# EAGLE schematic WM1302_915_SPI_without SX1262_SKY66420_v1.3 (EAGLE 6.4)
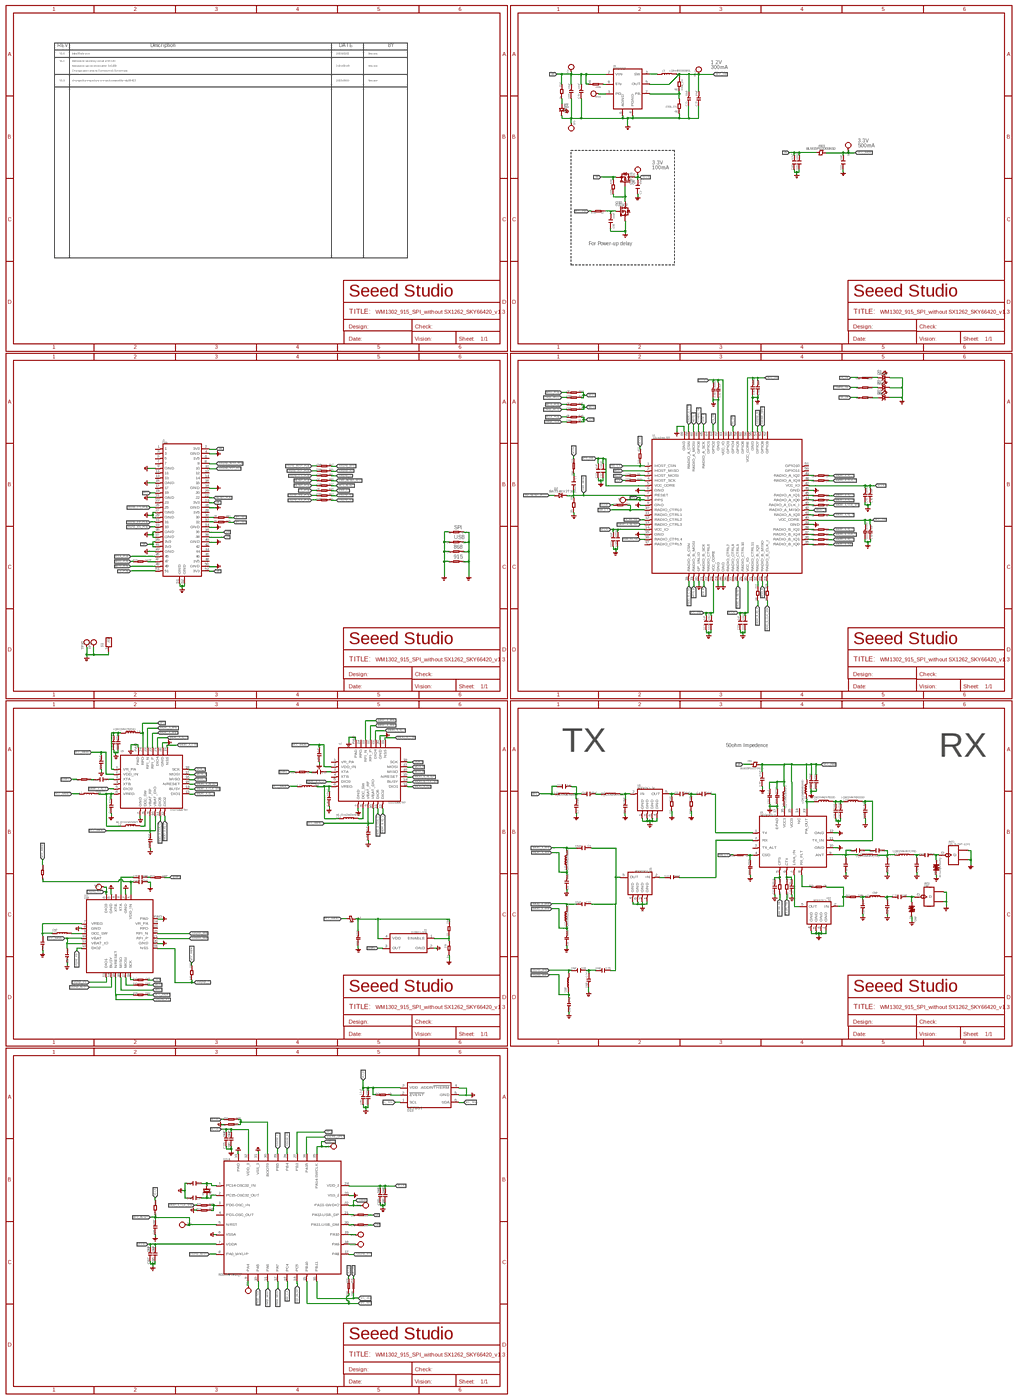
[diagram p0: schematic, sheet 1, overview]
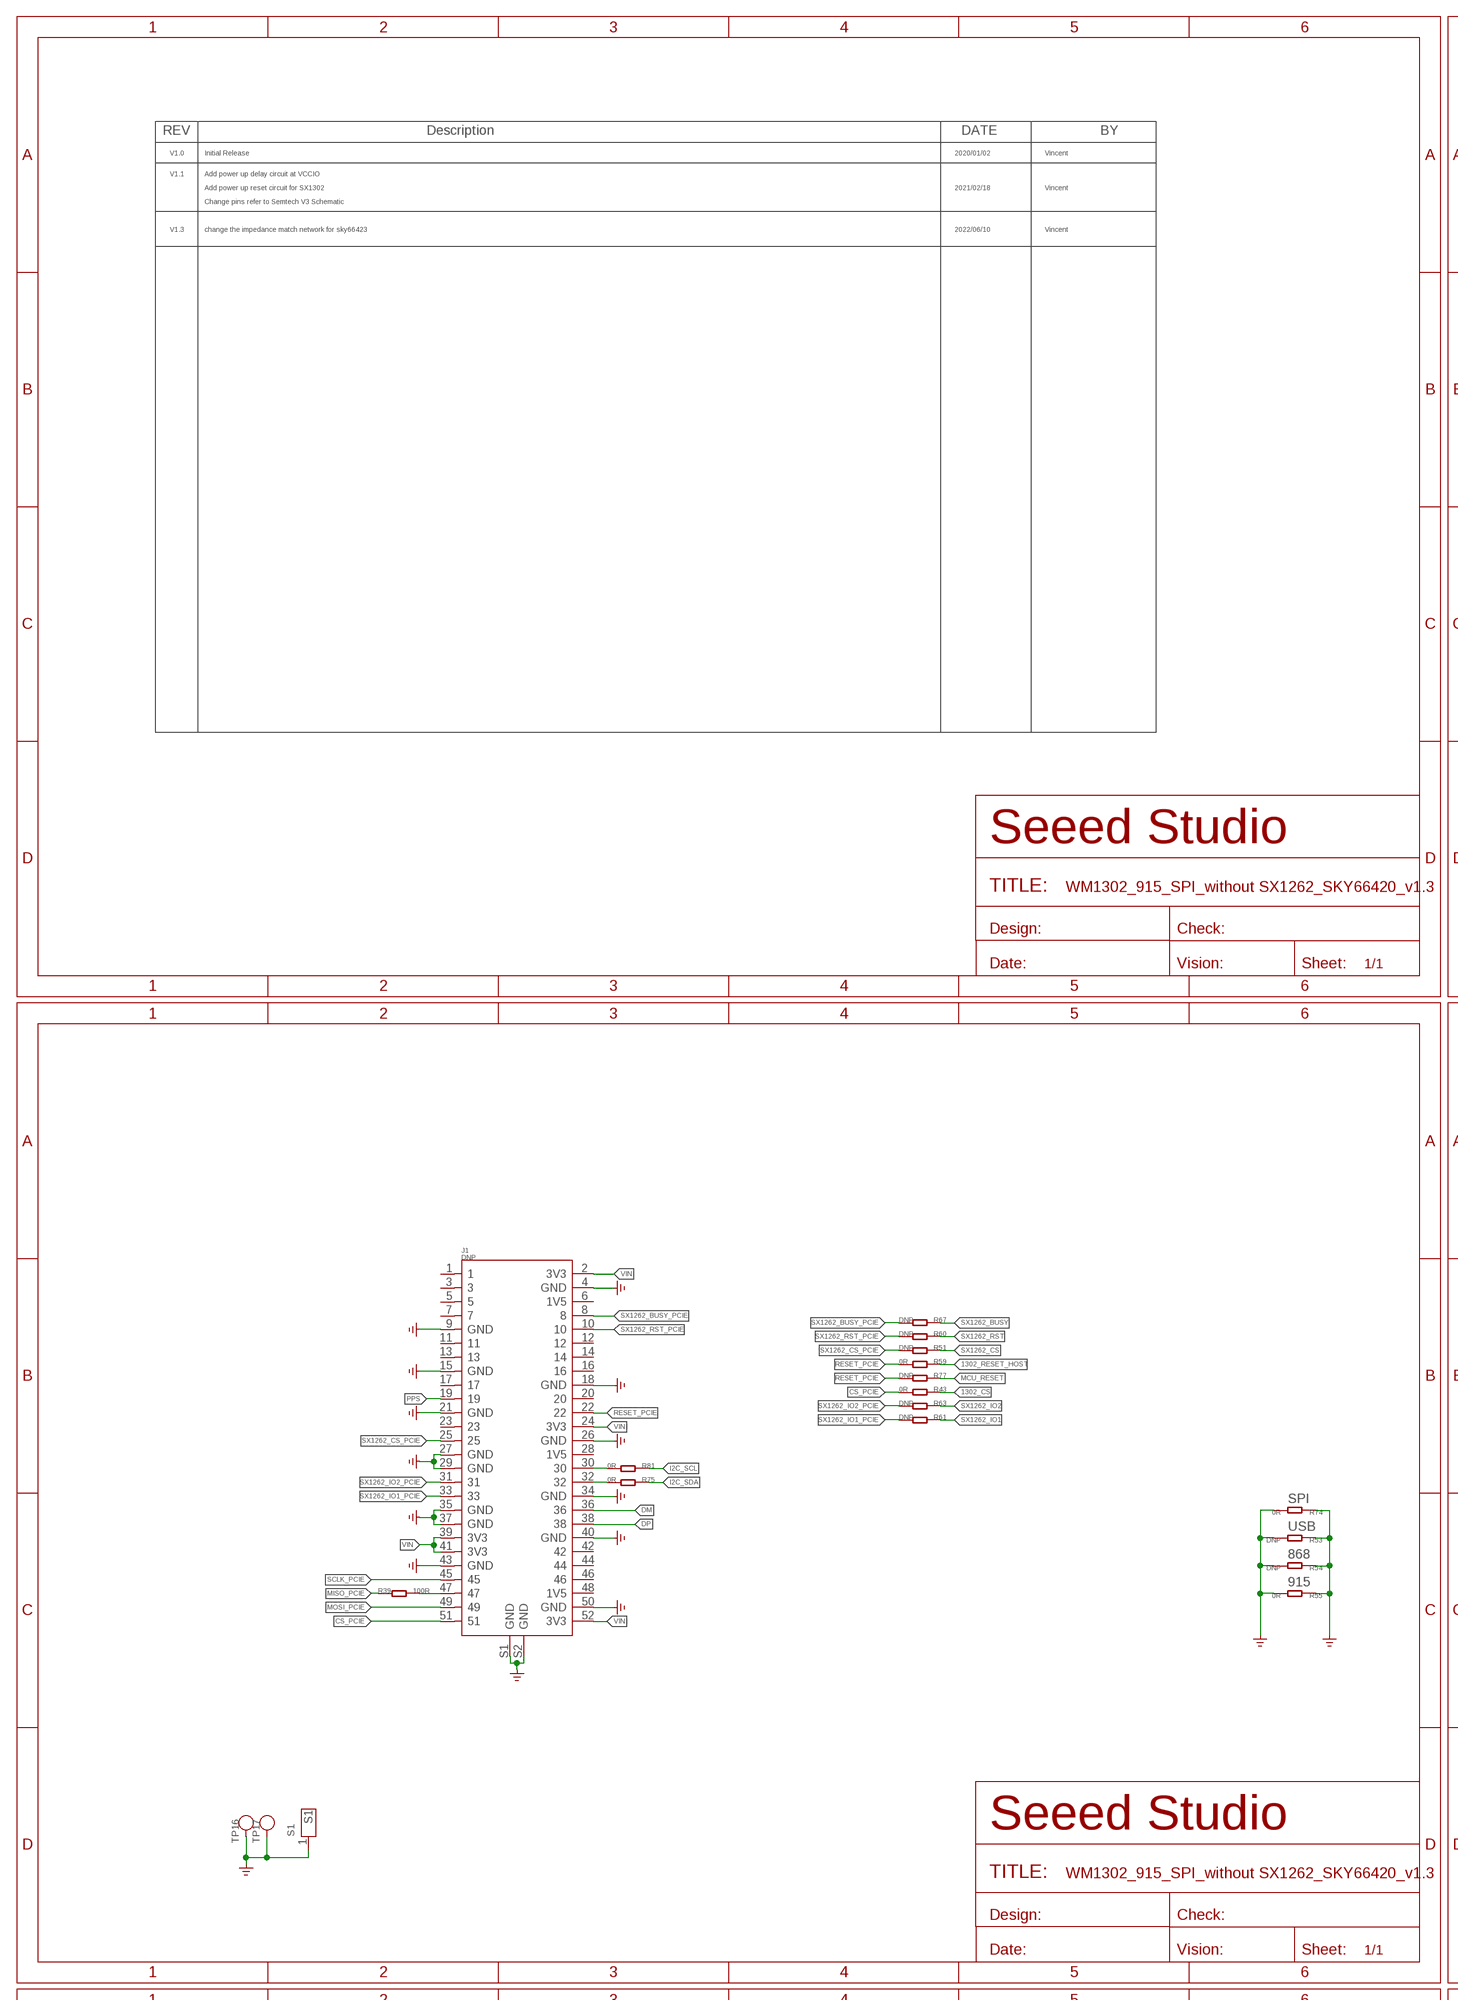
[diagram p1: schematic, sheet 1, part 1 of 4]
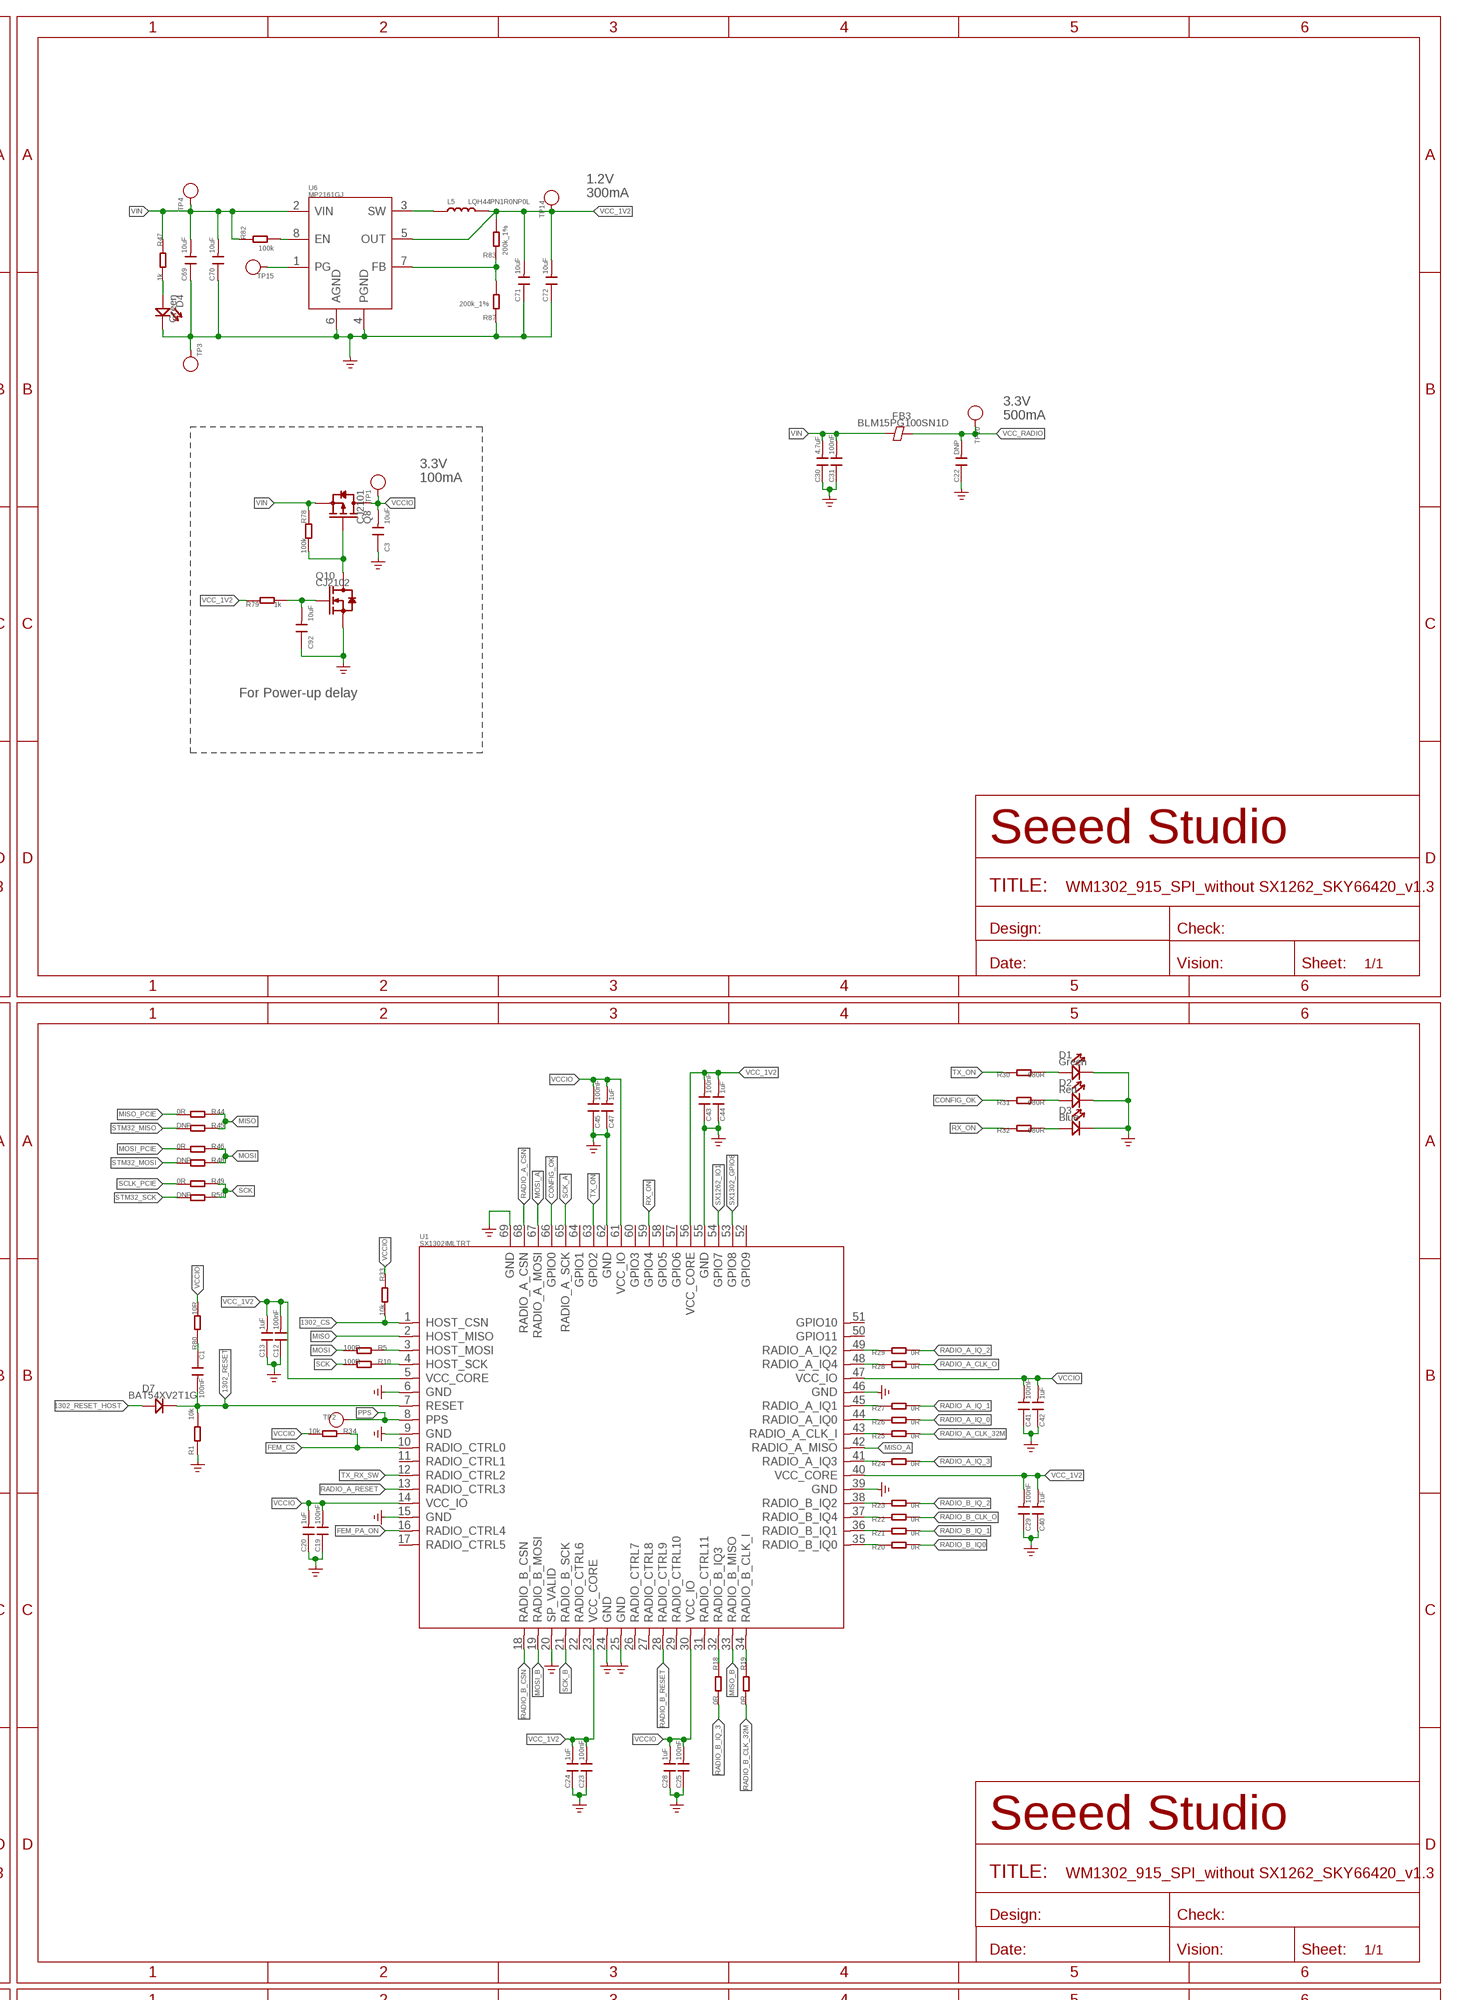
[diagram p2: schematic, sheet 1, part 2 of 4]
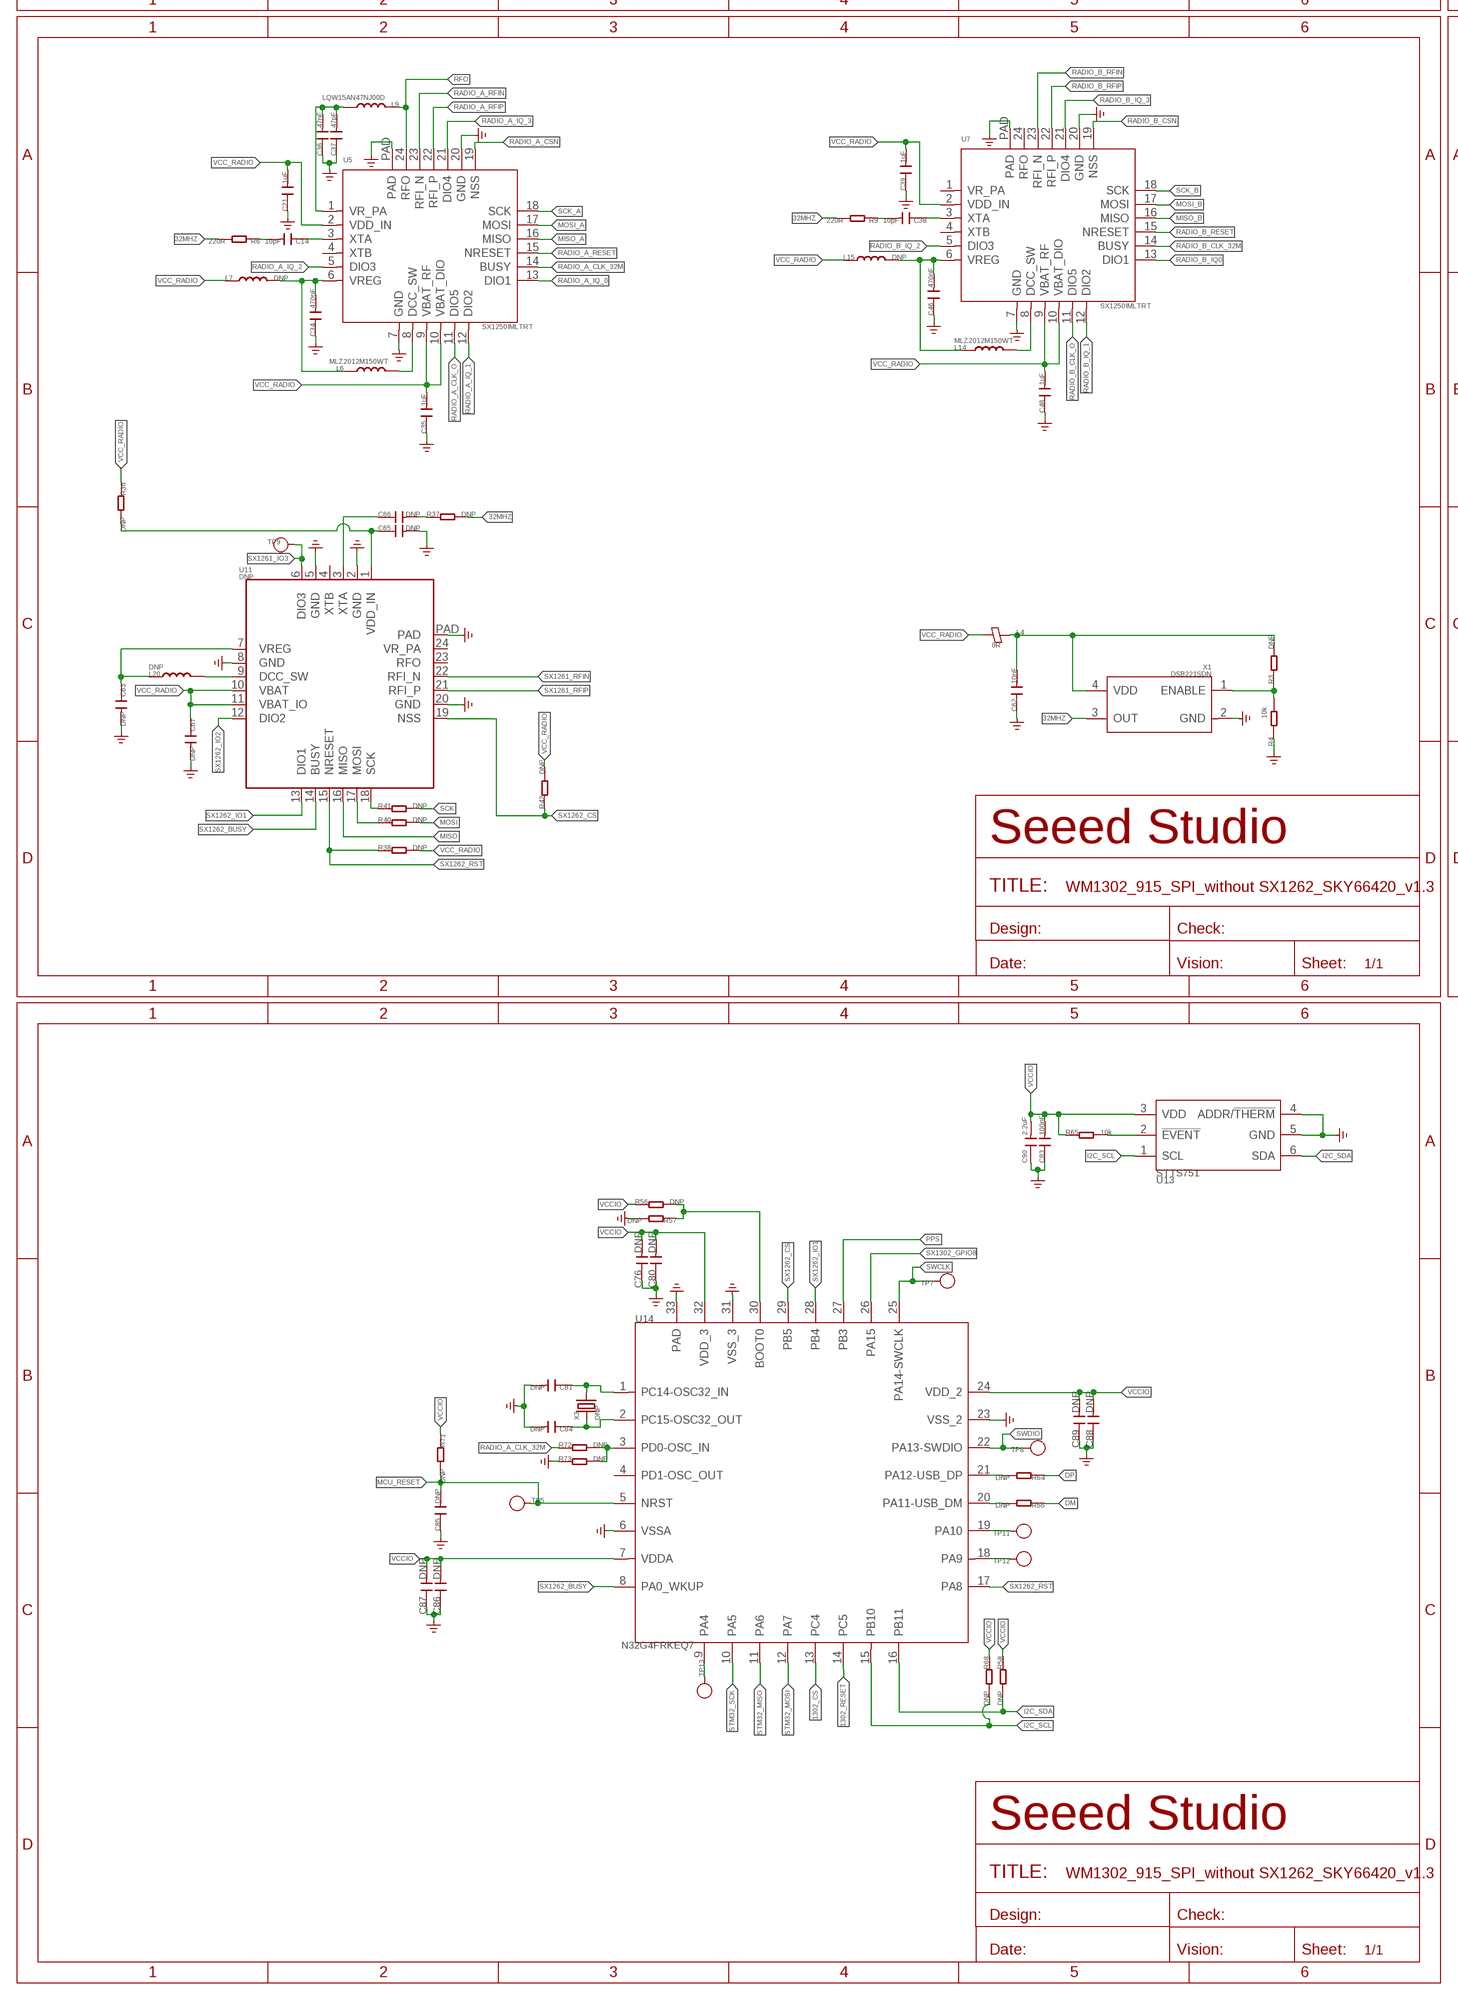
[diagram p3: schematic, sheet 1, part 3 of 4]
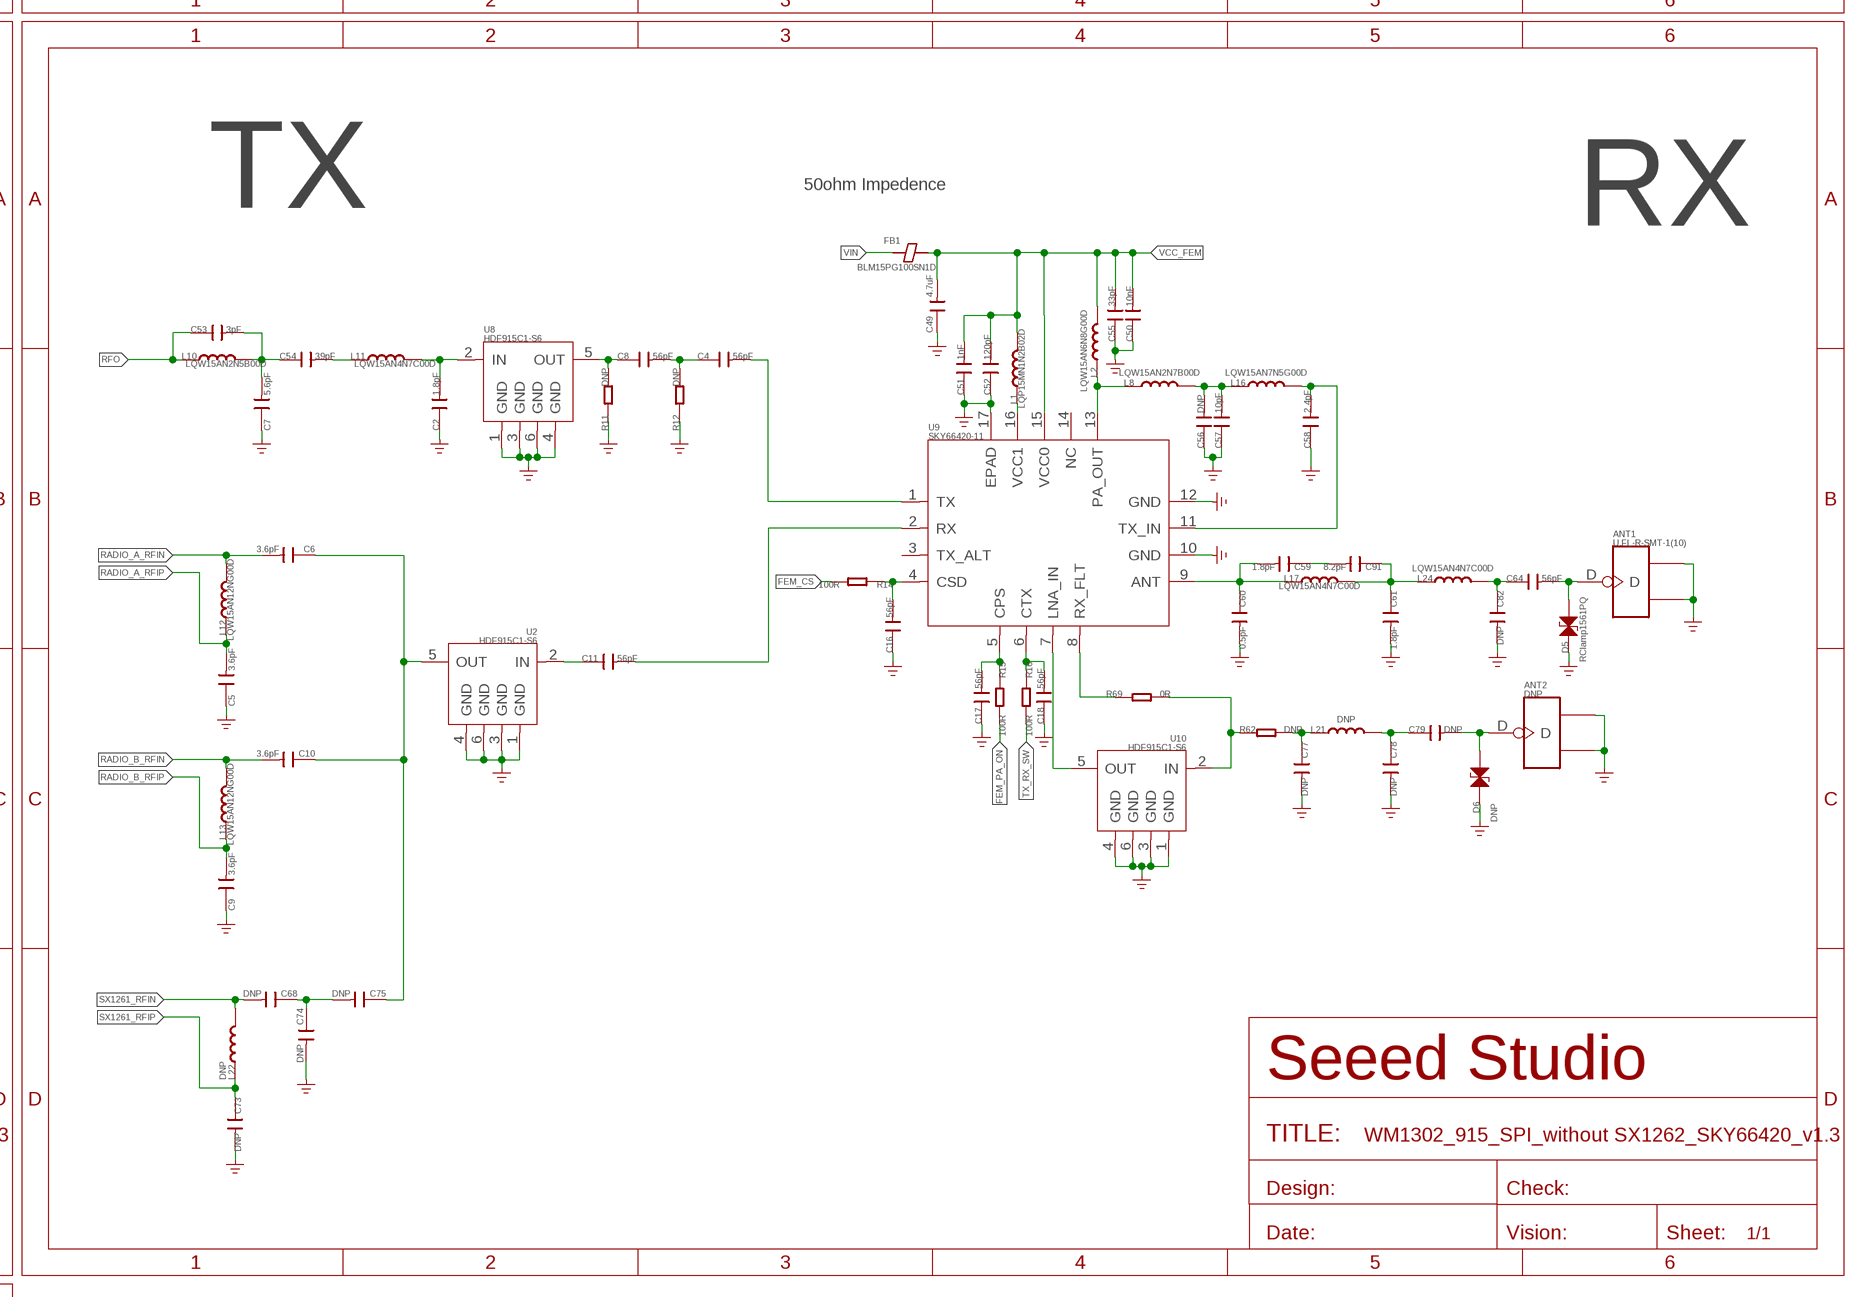
[diagram p4: schematic, sheet 1, part 4 of 4]

## Parts
ANT1  U.FL-R-SMT-1(10)  ANTENNA-U-FL-320110048  [U-FL3P-SMD-2.6X2.6X1.0MM]
ANT2  DNP  ANTENNA-U-FL-320110048  [U-FL3P-SMD-2.6X2.6X1.0MM]
C1  100nF  C-0402  [C0402]
C2  1.8pF  C-0402  [C0402]
C3  10uF  C-0603  [C0603]
C4  56pF  C-0402  [C0402]
C5  3.6pF  C-0402  [C0402]
C6  3.6pF  C-0402  [C0402]
C7  5.6pF  C-0402  [C0402]
C8  56pF  C-0402  [C0402]
C9  3.6pF  C-0402  [C0402]
C10  3.6pF  C-0402  [C0402]
C11  56pF  C-0402  [C0402]
C12  100nF  C-0402  [C0402]
C13  1uF  C-0402  [C0402]
C14  10pF  C-0402  [C0402]
C16  56pF  C-0402  [C0402]
C17  56pF  C-0402  [C0402]
C18  56pF  C-0402  [C0402]
C19  100nF  C-0402  [C0402]
C20  1uF  C-0402  [C0402]
C21  1uF  C-0402  [C0402]
C22  DNP  C-0402  [C0402]
C23  100nF  C-0402  [C0402]
C24  1uF  C-0402  [C0402]
C25  100nF  C-0402  [C0402]
C28  1uF  C-0402  [C0402]
C29  100nF  C-0402  [C0402]
C30  4.7uF  C-0603  [C0603]
C31  100nF  C-0402  [C0402]
C34  470nF  C-0402  [C0402]
C35  1uF  C-0402  [C0402]
C36  47nF  C-0402  [C0402]
C37  47pF  C-0402  [C0402]
C38  10pF  C-0402  [C0402]
C39  1uF  C-0402  [C0402]
C40  1uF  C-0402  [C0402]
C41  100nF  C-0402  [C0402]
C42  1uF  C-0402  [C0402]
C43  100nF  C-0402  [C0402]
C44  1uF  C-0402  [C0402]
C45  100nF  C-0402  [C0402]
C46  470nF  C-0402  [C0402]
C47  1uF  C-0402  [C0402]
C48  1uF  C-0402  [C0402]
C49  4.7uF  C-0603  [C0603]
C50  10nF  C-0402  [C0402]
C51  1nF  C-0402  [C0402]
C52  120pF  C-0402  [C0402]
C53  3pF  C-0402  [C0402]
C54  39pF  C-0402  [C0402]
C55  33pF  C-0402  [C0402]
C56  DNP  C-0402  [C0402]
C57  10pF  C-0402  [C0402]
C58  2.4pF  C-0402  [C0402]
C59  1.8pF  C-0402  [C0402]
C60  0.5pF  C-0402  [C0402]
C61  1.8pF  C-0402  [C0402]
C62  10nF  C-0402  [C0402]
C63  DNP  C-0402  [C0402]
C64  56pF  C-0402  [C0402]
C65  DNP  C-0402  [C0402]
C66  DNP  C-0402  [C0402]
C67  DNP  C-0402  [C0402]
C68  DNP  C-0402  [C0402]
C69  10uF  CAP-0805  [C0805]
C70  10uF  CAP-0805  [C0805]
C71  10uF  CAP-0805  [C0805]
C72  10uF  CAP-0805  [C0805]
C73  DNP  C-0402  [C0402]
C74  DNP  C-0402  [C0402]
C75  DNP  C-0402  [C0402]
C76  DNP  C-0402  [C0402]
C77  DNP  C-0402  [C0402]
C78  DNP  C-0402  [C0402]
C79  DNP  C-0402  [C0402]
C80  DNP  C-0402  [C0402]
C81  DNP  C-0402  [C0402]
C82  DNP  C-0402  [C0402]
C83  100nF  C-0402  [C0402]
C84  DNP  C-0402  [C0402]
C85  DNP  C-0402  [C0402]
C86  DNP  C-0402  [C0402]
C87  DNP  C-0402  [C0402]
C88  DNP  C-0402  [C0402]
C89  DNP  C-0402  [C0402]
C90  2.2uF  C-0603  [C0603]
C91  8.2pF  C-0402  [C0402]
C92  10uF  C-0603  [C0603]
D1  Green  LED-0402  [LED-0402]
D2  Red  LED-0402  [LED-0402]
D3  Blue  LED-0402  [LED-0402]
D4  Green  LED-0402  [LED-0402]
D5  RClamp1561PQ  D-ESD-2P-DOUBLE-0402  [ESD-0402]
D6  DNP  D-ESD-2P-DOUBLE-0402  [ESD-0402]
D7  BAT54XV2T1G  DIODE'0603'  [SOD-523]
FB1  BLM15PG100SN1D  FERRITE-BEAD-0402  [F0402]
FB3  BLM15PG100SN1D  FERRITE-BEAD-0402  [F0402]
J1  DNP  MOUDLE-FULL-MINI-PCIE  [PCIE52P-0.8-50.95X30MM]
L1  LQP15MN1N2B02D  L-0402  [L0402]
L2  LQW15AN6N8G00D  L-0402  [L0402]
L4  0R  FERRITE-BEAD-0603  [F0603]
L5  LQH44PN1R0NP0L  INDUCTOR-4430  [L4.4X3.0MM]
L6  MLZ2012M150WT  INDUCTOR-SPH202012  [L202012]
L7  DNP  L-0402  [L0402]
L8  LQW15AN2N7B00D  L-0402  [L0402]
L9  LQW15AN47NJ00D  L-0402  [L0402]
L10  LQW15AN2N5B00D  L-0402  [L0402]
L11  LQW15AN4N7C00D  L-0402  [L0402]
L12  LQW15AN12NG00D  L-0402  [L0402]
L13  LQW15AN12NG00D  L-0402  [L0402]
L14  MLZ2012M150WT  INDUCTOR-SPH202012  [L202012]
L15  DNP  L-0402  [L0402]
L16  LQW15AN7N5G00D  L-0402  [L0402]
L17  LQW15AN4N7C00D  L-0402  [L0402]
L20  DNP  INDUCTOR-SPH202012  [L202012]
L21  DNP  L-0402  [L0402]
L22  DNP  L-0402  [L0402]
L24  LQW15AN4N7C00D  L-0402  [L0402]
Q8  CJ2101  MOSFET-P-SOT323  [SOT-323]
Q10  CJ2102  MOSFET-N-SI1304BDL  [SOT-323]
R1  10k  R-0402  [R0402]
R3  DNP  R-0402  [R0402]
R4  10k  R-0402  [R0402]
R5  100R  R-0402  [R0402]
R6  220R  R-0402  [R0402]
R9  220R  R-0402  [R0402]
R10  100R  R-0402  [R0402]
R11  DNP  R-0402  [R0402]
R12  DNP  R-0402  [R0402]
R14  100R  R-0402  [R0402]
R15  100R  R-0402  [R0402]
R16  100R  R-0402  [R0402]
R18  0R  R-0402  [R0402]
R19  0R  R-0402  [R0402]
R20  0R  R-0402  [R0402]
R21  0R  R-0402  [R0402]
R22  0R  R-0402  [R0402]
R23  0R  R-0402  [R0402]
R24  0R  R-0402  [R0402]
R25  0R  R-0402  [R0402]
R26  0R  R-0402  [R0402]
R27  0R  R-0402  [R0402]
R28  0R  R-0402  [R0402]
R29  0R  R-0402  [R0402]
R30  680R  R-0402  [R0402]
R31  680R  R-0402  [R0402]
R32  680R  R-0402  [R0402]
R33  10k  R-0402  [R0402]
R34  10k  R-0402  [R0402]
R36  DNP  R-0402  [R0402]
R37  DNP  R-0402  [R0402]
R38  DNP  R-0402  [R0402]
R39  100R  R-0402  [R0402]
R40  DNP  R-0402  [R0402]
R41  DNP  R-0402  [R0402]
R42  DNP  R-0402  [R0402]
R43  0R  R-0402  [R0402]
R44  0R  R-0402  [R0402]
R45  DNP  R-0402  [R0402]
R46  0R  R-0402  [R0402]
R47  1k  R-0402  [R0402]
R48  DNP  R-0402  [R0402]
R49  0R  R-0402  [R0402]
R50  DNP  R-0402  [R0402]
R51  DNP  R-0402  [R0402]
R53  DNP  R-0402  [R0402]
R54  DNP  R-0402  [R0402]
R55  0R  R-0402  [R0402]
R56  DNP  R-0402  [R0402]
R57  DNP  R-0402  [R0402]
R58  DNP  R-0402  [R0402]
R59  0R  R-0402  [R0402]
R60  DNP  R-0402  [R0402]
R61  DNP  R-0402  [R0402]
R62  DNP  R-0402  [R0402]
R63  DNP  R-0402  [R0402]
R64  DNP  R-0402  [R0402]
R65  10k  R-0402  [R0402]
R66  DNP  R-0402  [R0402]
R67  DNP  R-0402  [R0402]
R68  DNP  R-0402  [R0402]
R69  0R  R-0402  [R0402]
R71  DNP  R-0402  [R0402]
R72  DNP  R-0402  [R0402]
R73  DNP  R-0402  [R0402]
R74  0R  R-0402  [R0402]
R75  0R  R-0402  [R0402]
R77  DNP  R-0402  [R0402]
R78  100k  R-0402  [R0402]
R79  1k  R-0402  [R0402]
R80  10R  R-0402  [R0402]
R81  0R  R-0402  [R0402]
R82  100k  R-0402  [R0402]
R83  200k_1%  R-0402  [R0402]
R87  200k_1%  R-0402  [R0402]
S1  SHIELD_CLIP-1302  [SHIELD_1302]
TP1  TEST-POINT-35  [TP_3535]
TP2  TEST-POINT-35  [TP_3535]
TP3  TEST-POINT-35  [TP_3535]
TP4  TEST-POINT-35  [TP_3535]
TP5  TEST-POINT-35  [TP_3535]
TP7  TEST-POINT-35  [TP_3535]
TP8  TEST-POINT-35  [TP_3535]
TP9  TEST-POINT-35  [TP_3535]
TP10  TEST-POINT-35  [TP_3535]
TP11  TEST-POINT-35  [TP_3535]
TP12  TEST-POINT-35  [TP_3535]
TP13  TEST-POINT-35  [TP_3535]
TP14  TEST-POINT-35  [TP_3535]
TP15  TEST-POINT'4545'  [TP-D45MIL]
TP16  TEST-POINT-1.9X0.3MM  [TEST-1.9X0.3MM]
TP17  TEST-POINT-1.9X0.3MM  [TEST-1.9X0.3MM]
U1  SX1302IMLTRT  TRANSCEIVER-SX1302  [QFN68-0.35-7X7X0.75MM]
U2  HDF915C1-S6  FILTER-B39871B3717U410  [FILTER6P-1.1-3X3X1.3MM]
U5  SX1250IMLTRT  RF-SX1250  [QFN24G-0.5-4X4MM]
U6  MP2161GJ  PMIC-MP2161'GJ'  [TSOT23-8]
U7  SX1250IMLTRT  RF-SX1250  [QFN24G-0.5-4X4MM]
U8  HDF915C1-S6  FILTER-B39871B3717U410  [FILTER6P-1.1-3X3X1.3MM]
U9  SKY66420-11  MODULE-RF-SKY66420-11  [MODULE16P-0.5-3X3X0.75MM]
U10  HDF915C1-S6  FILTER-B39871B3717U410  [FILTER6P-1.1-3X3X1.3MM]
U11  DNP  TRANSCEIVER-SX1261/2  [QFN24G-0.5-4X4MM]
U13  STTS751  SENSOR-STTS751  [UDFN-6L]
U14  N32G4FRKEQ7  MCU-N32G4FRKCQ7  [QFN32G-0.4-4X4MM]
X1  DSB221SDN  CRYSTAL-OSCILLATOR-2520  [X4-SMD-2.5X2.0X1.0MM]
X3  DNP  CRYSTAL-2P-3215  [X2-SMD-3.2X1.5X0.55MM]

## Nets
32MHZ: R6.2 R9.2 R37.2 X1.3(OUT)
1302_CS: R33.2 R43.1 U1.1(HOST_CSN) U14.13(PC4)
1302_RESET: C1.2 D7.- R1.2 U1.7(RESET) U14.14(PC5)
1302_RESET_HOST: D7.+ R59.1
CONFIG_OK: R31.1 U1.66(GPIO0)
CS_PCIE: J1.51 R43.2
DM: J1.36 R66.1
DP: J1.38 R64.1
FEM_CS: R14.2 R34.1 U1.10(RADIO_CTRL0)
FEM_PA_ON: R15.2 U1.16(RADIO_CTRL4)
GND: ANT1.GND1 ANT1.GND2 ANT2.GND1 ANT2.GND2 C2.1 C3.1 C5.1 C7.1 C9.1 C12.1 C13.1 C16.1 C17.1 C18.1 C19.1 C20.1 C21.1 C22.1 C23.1 C24.1 C25.1 C28.1 C29.1 C30.1 C31.1 C34.1 C35.1 C36.1 C37.1 C39.1 C40.1 C41.1 C42.1 C43.1 C44.1 C45.1 C46.1 C47.1 C48.1 C49.1 C50.1 C51.1 C52.1 C55.1 C56.1 C57.1 C58.1 C60.2 C61.2 C62.1 C63.2 C65.2 C67.2 C69.1 C70.1 C71.1 C72.1 C73.2 C74.2 C76.1 C77.2 C78.2 C80.1 C81.2 C82.2 C83.1 C84.2 C85.1 C86.1 C87.1 C88.1 C89.1 C90.1 C92.1 D1.- D2.- D3.- D4.- D5.1 D6.1 J1.4(GND) J1.9(GND) J1.15(GND) J1.18(GND) J1.21(GND) J1.26(GND) J1.27(GND) J1.29(GND) J1.34(GND) J1.35(GND) J1.37(GND) J1.40(GND) J1.43(GND) J1.50(GND) J1.S1(GND) J1.S2(GND) Q10.2(S) R1.1 R4.1 R11.1 R12.1 R53.1 R53.2 R54.1 R54.2 R55.1 R55.2 R57.2 R73.1 R74.1 R74.2 R87.1 S1.1(S1) TP3.T TP16.1(T) TP17.1(T) U1.6(GND) U1.9(GND) U1.15(GND) U1.20(SP_VALID) U1.24(GND) U1.25(GND) U1.39(GND) U1.46(GND) U1.55(GND) U1.62(GND) U1.69(GND) U2.1(GND) U2.3(GND) U2.4(GND) U2.6(GND) U5.7(GND) U5.20(GND) U5.PAD U6.4(PGND) U6.6(AGND) U7.7(GND) U7.20(GND) U7.PAD U8.1(GND) U8.3(GND) U8.4(GND) U8.6(GND) U9.10(GND) U9.12(GND) U9.17(EPAD) U10.1(GND) U10.3(GND) U10.4(GND) U10.6(GND) U11.2(GND) U11.5(GND) U11.8(GND) U11.20(GND) U11.PAD U13.4(ADDR/!THERM) U13.5(GND) U14.6(VSSA) U14.23(VSS_2) U14.31(VSS_3) U14.33(PAD) X1.2(GND) ; supply symbol labelled GND_POWER
I2C_SCL: R68.2 R81.1 U13.1(SCL) U14.15(PB10)
I2C_SDA: R58.2 R75.1 U13.6(SDA) U14.16(PB11)
MCU_RESET: C85.2 R71.2 R77.1 TP5.T U14.5(NRST)
MISO: R44.1 R45.1 U1.2(HOST_MISO) U11.16(MISO)
MISO_A: U1.42(RADIO_A_MISO) U5.16(MISO)
MISO_B: U1.33(RADIO_B_MISO) U7.16(MISO)
MISO_PCIE: R39.1 R44.2
MOSI: R5.2 R40.2 R46.1 R48.1
MOSI_A: U1.67(RADIO_A_MOSI) U5.17(MOSI)
MOSI_B: U1.19(RADIO_B_MOSI) U7.17(MOSI)
MOSI_PCIE: J1.49 R46.2
N$1: C11.2 U9.2(RX)
N$2: TP15.T U6.1(PG)
N$3: C8.1 R11.2 U8.5(OUT)
N$4: C2.2 L11.2 U8.2(IN)
N$5: C11.1 U2.2(IN)
N$6: C4.2 U9.1(TX)
N$7: C68.1 C74.1 C75.2
N$8: C65.1 R36.2 U11.1(VDD_IN)
N$9: C66.2 R37.1
N$10: L5.1 U6.3(SW)
N$11: R83.1 R87.2 U6.7(FB)
N$12: R3.1 R4.2 X1.1(ENABLE)
N$13: C14.1 U5.3(XTA)
N$14: C62.2 L4.1 R3.2 X1.4(VDD)
N$15: R5.1 U1.3(HOST_MOSI)
N$16: D4.+ R47.2
N$17: R10.1 U1.4(HOST_SCK)
N$20: R82.2 U6.8(EN)
N$22: TP11.T U14.19(PA10)
N$23: C14.2 R6.1
N$24: L6.2 U5.8(DCC_SW)
N$25: C34.2 L6.1 L7.2 U5.6(VREG)
N$26: C64.1 C82.1 L24.2
N$27: R19.1 U1.34(RADIO_B_CLK_I)
N$28: C16.2 R14.1 U9.4(CSD)
N$29: C38.1 U7.3(XTA)
N$31: C36.2 C37.2 L9.2 U5.1(VR_PA)
N$32: C38.2 R9.1
N$33: L14.2 U7.8(DCC_SW)
N$34: C46.2 L14.1 L15.2 U7.6(VREG)
N$35: C54.2 L11.1
N$36: C7.2 C53.2 C54.1 L10.2
N$37: C4.1 C8.2 R12.2
N$38: C17.2 R15.1 U9.5(CPS)
N$39: C18.2 R16.1 U9.6(CTX)
N$40: TP12.T U14.18(PA9)
N$41: R18.1 U1.32(RADIO_B_IQ3)
N$42: R20.1 U1.35(RADIO_B_IQ0)
N$43: R24.1 U1.41(RADIO_A_IQ3)
N$44: R21.1 U1.36(RADIO_B_IQ1)
N$45: R22.1 U1.37(RADIO_B_IQ4)
N$59: R23.1 U1.38(RADIO_B_IQ2)
N$60: R25.1 U1.43(RADIO_A_CLK_I)
N$74: R26.1 U1.44(RADIO_A_IQ0)
N$75: R27.1 U1.45(RADIO_A_IQ1)
N$78: R28.1 U1.48(RADIO_A_IQ4)
N$79: R29.1 U1.49(RADIO_A_IQ2)
N$80: D3.+ R32.2
N$81: D2.+ R31.2
N$82: D1.+ R30.2
N$83: Q8.1(G) Q10.3(D) R78.2
N$84: C1.1 R80.1
N$85: L1.1 U9.16(VCC1)
N$86: L2.1 L8.1 U9.13(PA_OUT)
N$88: C56.2 C57.2 L8.2 L16.1
N$89: C58.2 L16.2 U9.11(TX_IN)
N$90: C59.2 C60.1 L17.1 U9.9(ANT)
N$92: C61.1 C91.1 L17.2 L24.1
N$93: C66.1 U11.3(XTA)
N$94: ANT1.D C64.2 D5.2
N$100: R62.1 R69.2 U10.2(IN)
N$101: C63.1 L20.1 U11.7(VREG)
N$102: U9.7(LNA_IN) U10.5(OUT)
N$103: L20.2 U11.9(DCC_SW)
N$104: J1.47 R39.2
N$105: R40.1 U11.17(MOSI)
N$106: R41.1 U11.18(SCK)
N$107: C6.1 C10.1 C75.1 U2.5(OUT)
N$108: R69.1 U9.8(RX_FLT)
N$109: C78.1 C79.1 L21.2
N$110: ANT2.D C79.2 D6.2
N$111: C59.1 C91.2
N$119: C77.1 L21.1 R62.2
N$120: R65.2 U13.2(!EVENT)
N$121: TP13.T U14.9(PA4)
N$122: R64.2 U14.21(PA12-USB_DP)
N$123: R66.2 U14.20(PA11-USB_DM)
N$124: C92.2 Q10.1(G) R79.2
N$125: R56.2 R57.1 U14.30(BOOT0)
N$126: R72.2 R73.2 U14.3(PD0-OSC_IN)
N$127: C81.1 U14.1(PC14-OSC32_IN) X3.2
N$128: C84.1 U14.2(PC15-OSC32_OUT) X3.1
N$133: J1.30 R81.2
N$134: J1.32 R75.2
PPS: J1.19 TP2.T U1.8(PPS) U14.27(PB3)
RADIO_A_CLK_32M: R25.2 R72.1 U5.14(BUSY)
RADIO_A_CLK_O: R28.2 U5.11(DIO5)
RADIO_A_CSN: U1.68(RADIO_A_CSN) U5.19(NSS)
RADIO_A_IQ_0: R26.2 U5.13(DIO1)
RADIO_A_IQ_1: R27.2 U5.12(DIO2)
RADIO_A_IQ_2: R29.2 U5.5(DIO3)
RADIO_A_IQ_3: R24.2 U5.21(DIO4)
RADIO_A_RESET: U1.13(RADIO_CTRL3) U5.15(NRESET)
RADIO_A_RFIN: C6.2 L12.2 U5.23(RFI_N)
RADIO_A_RFIP: C5.2 L12.1 U5.22(RFI_P)
RADIO_B_CLK_32M: R19.2 U7.14(BUSY)
RADIO_B_CLK_O: R22.2 U7.11(DIO5)
RADIO_B_CSN: U1.18(RADIO_B_CSN) U7.19(NSS)
RADIO_B_IQ0: R20.2 U7.13(DIO1)
RADIO_B_IQ_1: R21.2 U7.12(DIO2)
RADIO_B_IQ_2: R23.2 U7.5(DIO3)
RADIO_B_IQ_3: R18.2 U7.21(DIO4)
RADIO_B_RESET: U1.28(RADIO_CTRL9) U7.15(NRESET)
RADIO_B_RFIN: C10.2 L13.2 U7.23(RFI_N)
RADIO_B_RFIP: C9.2 L13.1 U7.22(RFI_P)
RESET_PCIE: J1.22 R59.2 R77.2
RFO: C53.1 L9.1 L10.1 U5.24(RFO)
RX_ON: R32.1 U1.59(GPIO4)
SCK: R10.2 R41.2 R49.1 R50.1
SCK_A: U1.65(RADIO_A_SCK) U5.18(SCK)
SCK_B: U1.21(RADIO_B_SCK) U7.18(SCK)
SCLK_PCIE: J1.45 R49.2
STM32_MISO: R45.2 U14.11(PA6)
STM32_MOSI: R48.2 U14.12(PA7)
STM32_SCK: R50.2 U14.10(PA5)
SWCLK: TP7.T U14.25(PA14-SWCLK)
SWDIO: TP8.T U14.22(PA13-SWDIO)
SX1261_IO3: TP9.T U11.6(DIO3)
SX1261_RFIN: C68.2 L22.2 U11.22(RFI_N)
SX1261_RFIP: C73.1 L22.1 U11.21(RFI_P)
SX1262_BUSY: R67.1 U11.14(BUSY) U14.8(PA0_WKUP)
SX1262_BUSY_PCIE: J1.8 R67.2
SX1262_CS: R42.1 R51.1 U11.19(NSS) U14.29(PB5)
SX1262_CS_PCIE: J1.25 R51.2
SX1262_IO1: R61.1 U1.54(GPIO7) U11.13(DIO1) U14.28(PB4)
SX1262_IO1_PCIE: J1.33 R61.2
SX1262_IO2: R63.1 U11.12(DIO2)
SX1262_IO2_PCIE: J1.31 R63.2
SX1262_RST: R38.1 R60.1 U11.15(NRESET) U14.17(PA8)
SX1262_RST_PCIE: J1.10 R60.2
SX1302_GPIO8: U1.53(GPIO8) U14.26(PA15)
TX_ON: R30.1 U1.63(GPIO2)
TX_RX_SW: R16.2 U1.12(RADIO_CTRL2)
VCC_1V2: C12.2 C13.2 C23.2 C24.2 C29.2 C40.2 C43.2 C44.2 C71.2 C72.2 L5.2 R79.1 R83.2 TP14.T U1.5(VCC_CORE) U1.23(VCC_CORE) U1.40(VCC_CORE) U1.56(VCC_CORE) U6.5(OUT)
VCC_FEM: C49.2 C50.2 C51.2 C52.2 C55.2 FB1.2 L1.2 L2.2 U9.15(VCC0)
VCC_RADIO: C21.2 C22.2 C35.2 C39.2 C48.2 C67.1 FB3.2 L4.2 L7.1 L15.1 R36.1 R38.2 R42.2 TP10.T U5.2(VDD_IN) U5.9(VBAT_RF) U5.10(VBAT_DIO) U7.2(VDD_IN) U7.9(VBAT_RF) U7.10(VBAT_DIO) U11.10(VBAT) U11.11(VBAT_IO)
VCCIO: C3.2 C19.2 C20.2 C25.2 C28.2 C41.2 C42.2 C45.2 C47.2 C76.2 C80.2 C83.2 C86.2 C87.2 C88.2 C89.2 C90.2 Q8.3(D) R33.1 R34.2 R56.1 R58.1 R65.1 R68.1 R71.1 R80.2 TP1.T U1.14(VCC_IO) U1.30(VCC_IO) U1.47(VCC_IO) U1.61(VCC_IO) U13.3(VDD) U14.7(VDDA) U14.24(VDD_2) U14.32(VDD_3)
VIN: C30.2 C31.2 C69.2 C70.2 FB1.1 FB3.1 J1.2(3V3) J1.24(3V3) J1.39(3V3) J1.41(3V3) J1.52(3V3) Q8.2(S) R47.1 R78.1 R82.1 TP4.T U6.2(VIN)
Unconnected: J1.1 J1.3 J1.5 J1.6(1V5) J1.7 J1.11 J1.12 J1.13 J1.14 J1.16 J1.17 J1.20 J1.23 J1.28(1V5) J1.42 J1.44 J1.46 J1.48(1V5) U1.11(RADIO_CTRL1) U1.17(RADIO_CTRL5) U1.22(RADIO_CTRL6) U1.26(RADIO_CTRL7) U1.27(RADIO_CTRL8) U1.29(RADIO_CTRL10) U1.31(RADIO_CTRL11) U1.50(GPIO11) U1.51(GPIO10) U1.52(GPIO9) U1.57(GPIO6) U1.58(GPIO5) U1.60(GPIO3) U1.64(GPIO1) U5.4(XTB) U7.1(VR_PA) U7.4(XTB) U7.24(RFO) U9.3(TX_ALT) U9.14(NC) U11.4(XTB) U11.23(RFO) U11.24(VR_PA) U14.4(PD1-OSC_OUT)

## Notes on the sheet
- V1.0 | Initial Release | 2020/01/02 | Vincent
- V1.1 | Add power up delay circuit at VCCIO
- 1.2V
- Add power up reset circuit for SX1302 | 2021/02/18 | Vincent
- 300mA
- Change pins refer to Semtech V3 Schematic
- V1.3 | change the impedance match network for sky66423 | 2022/06/10 | Vincent
- 3.3V
- 500mA
- 3.3V
- 100mA
- For Power-up delay
- SPI
- USB
- 868
- 915
- 50ohm Impedence
- TX | RX

## Library data of the parts
ANT1 ANT2 = Connector-new:ANTENNA-U-FL; SPICEPREFIX: J
C1-C14 C16-C25 C28-C31 C34-C54 C56-C68 C73-C92 = Discrete-small:C*: Ceramic Capacitors
C55 = Discrete-small:C*: Ceramic Capacitors; SPICEPREFIX: C
C69-C72 = Discrete-new:CAP: Ceramic Capacitors
D1-D4 = Discrete-new:LED
D5 = Discrete-small:D-ESD-2P-DOUBLE; SPICEPREFIX: D
D6 = Discrete-small:D-ESD-2P-DOUBLE
D7 = Discrete-new:DIODE
FB1 FB3 L4 = Discrete-new:FERRITE-BEAD
J1 = moudle-new:MOUDLE-FULL-MINI-PCIE
L1 L2 L7-L13 L15-L17 L21 L22 L24 = Discrete-small:L
L5 L6 L14 L20 = Discrete-new:INDUCTOR
Q8 = Discrete-new:MOSFET-P
Q10 = Discrete-new:MOSFET-N: IRLL014: http://www.vishay.com/docs/91319/sihll014.pdf
R1 R3-R6 R9-R12 R14-R16 R18-R34 R36-R51 R53-R69 R71-R75 R77-R83 R87 = Discrete-small:R*
S1 = Connector-new:SHIELD_CLIP
TP1-TP5 TP7-TP14 TP16 TP17 = Discrete-new:TEST-POINT
TP15 = Discrete-new:TEST-POINT; PARTNO: DNP
U1 = IC-new:TRANSCEIVER-SX1302
U2 U8 U10 = Discrete-new:FILTER-B39871B3717U410
U5 U7 = IC-new:RF-SX1250
U6 = IC-new:PMIC-MP2161
U9 = moudle-new:MODULE-RF-SKY66420-11
U11 = IC-new:TRANSCEIVER
U13 = Sensor:SENSOR-STTS751
U14 = IC-new:MCU-N32G4FRKCQ7
X1 = Discrete-new:CRYSTAL-OSCILLATOR
X3 = Discrete-new:CRYSTAL-2P